# EAGLE board STM32F446 front pane - northeast - v3 (EAGLE 9.6.2), part 1 of 2
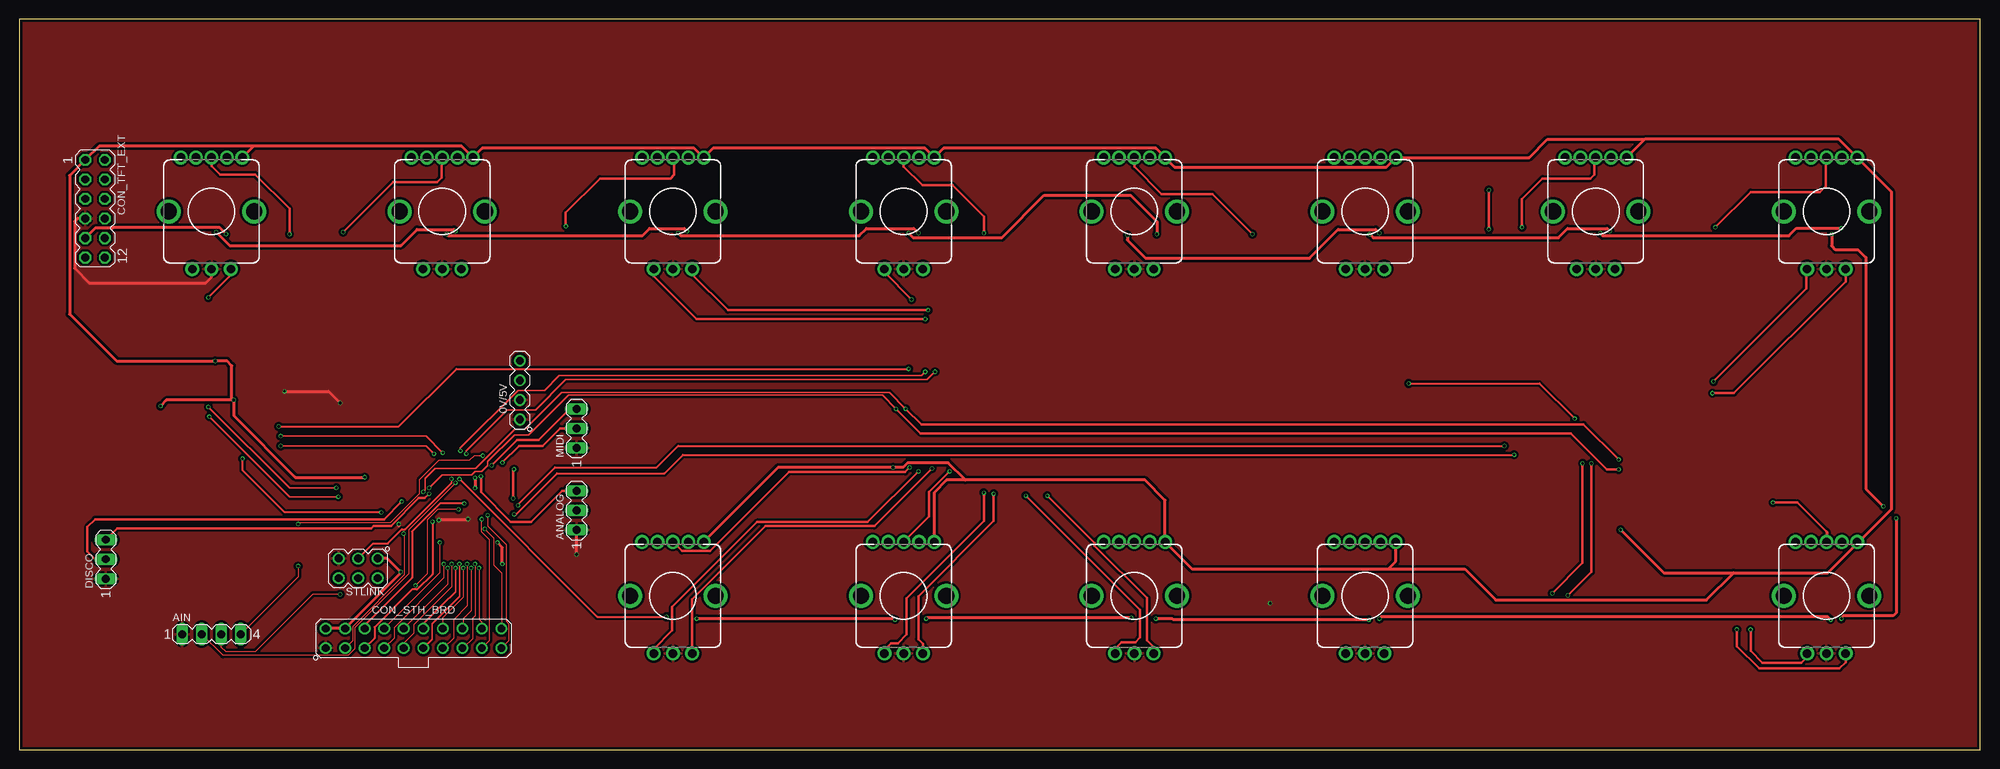
[diagram p5: board, top side]
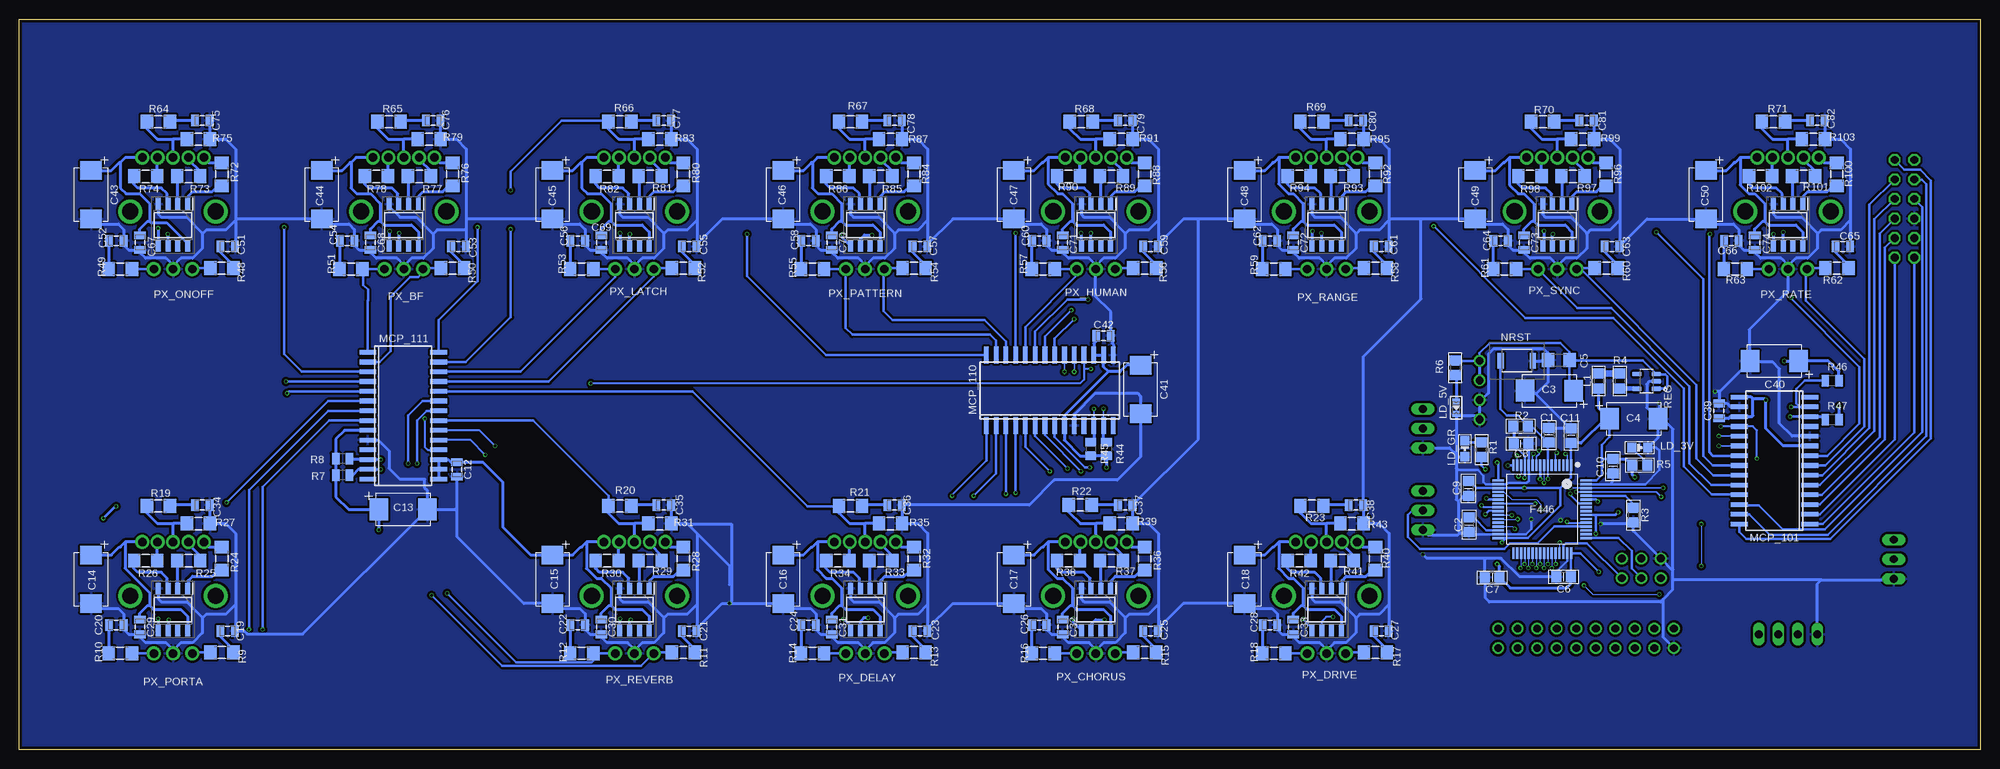
[diagram p6: board, bottom side, seen from below]

Size 255 x 95 mm. Coordinates in mm from the lower left corner, seen from the top.
Outline: 0,0 255,0 255,95 0,95 0,0
Copper layers (1*16): Top 0.035559375mm / dielectric 1.6mm / Bottom 0.035559375mm
Design rules "jlcpcb2layer": minimum track width 5mil, minimum drill 12mil, track to track 5mil, track to pad 5mil, pad to pad 5mil, via to via 5mil, smd to smd 5mil, copper to edge 8mil, drill to drill 6mil, minimum pad ring 5mil, minimum via ring 3mil, stop-mask expansion 2.5mil, vias tented up to drill 0mil, thermal gap 10mil

## Footprints (pad centres in the part's own frame; a part is rotated, then mirrored left to right if it is on the bottom)
MA04-1 = drill 1.016: 1 -3.81,0; 2 -1.27,0; 3 1.27,0; 4 3.81,0
MA04-1' = drill 1.016 long: 1 -3.81,0; 2 -1.27,0; 3 1.27,0; 4 3.81,0
MA03-1 = drill 1.016 long: 1 -2.54,0; 2 0,0; 3 2.54,0
C0805 = smd 1.3 x 1.5: 1 -0.95,0; 2 0.95,0
CPOL2917 = smd 2.4 x 2.8: + -3.15,0; - 3.15,0
C1206 = smd 1.6 x 1.8: 1 -1.4,0; 2 1.4,0
0805-CAP = smd 1 x 1.5: 1 -0.95,0; 2 0.95,0
MA10-2 = drill 1.016: 1 -11.43,-1.27; 2 -11.43,1.27; 3 -8.89,-1.27; 4 -8.89,1.27; 5 -6.35,-1.27; 6 -6.35,1.27; 7 -3.81,-1.27; 8 -3.81,1.27; 9 -1.27,-1.27; 10 -1.27,1.27; 11 1.27,-1.27; 12 1.27,1.27; 13 3.81,-1.27; 14 3.81,1.27; 15 6.35,-1.27; 16 6.35,1.27; 17 8.89,-1.27; 18 8.89,1.27; 19 11.43,-1.27; 20 11.43,1.27
MA06-2 = drill 1.016 octagon: 1 -6.35,-1.27; 2 -6.35,1.27; 3 -3.81,-1.27; 4 -3.81,1.27; 5 -1.27,-1.27; 6 -1.27,1.27; 7 1.27,-1.27; 8 1.27,1.27; 9 3.81,-1.27; 10 3.81,1.27; 11 6.35,-1.27; 12 6.35,1.27
QFP50P1200X1200X160-64N = smd 1.5 x 0.3: 1 -5.7,3.75; 2 -5.7,3.25; 3 -5.7,2.75; 4 -5.7,2.25; 5 -5.7,1.75; 6 -5.7,1.25; 7 -5.7,0.75; 8 -5.7,0.25; 9 -5.7,-0.25; 10 -5.7,-0.75; 11 -5.7,-1.25; 12 -5.7,-1.75; 13 -5.7,-2.25; 14 -5.7,-2.75; 15 -5.7,-3.25; 16 -5.7,-3.75; 33 5.7,-3.75; 34 5.7,-3.25; 35 5.7,-2.75; 36 5.7,-2.25; 37 5.7,-1.75; 38 5.7,-1.25; 39 5.7,-0.75; 40 5.7,-0.25; 41 5.7,0.25; 42 5.7,0.75; 43 5.7,1.25; 44 5.7,1.75; 45 5.7,2.25; 46 5.7,2.75; 47 5.7,3.25; 48 5.7,3.75 | smd 0.3 x 1.5: 17 -3.75,-5.7; 18 -3.25,-5.7; 19 -2.75,-5.7; 20 -2.25,-5.7; 21 -1.75,-5.7; 22 -1.25,-5.7; 23 -0.75,-5.7; 24 -0.25,-5.7; 25 0.25,-5.7; 26 0.75,-5.7; 27 1.25,-5.7; 28 1.75,-5.7; 29 2.25,-5.7; 30 2.75,-5.7; 31 3.25,-5.7; 32 3.75,-5.7; 49 3.75,5.7; 50 3.25,5.7; 51 2.75,5.7; 52 2.25,5.7; 53 1.75,5.7; 54 1.25,5.7; 55 0.75,5.7; 56 0.25,5.7; 57 -0.25,5.7; 58 -0.75,5.7; 59 -1.25,5.7; 60 -1.75,5.7; 61 -2.25,5.7; 62 -2.75,5.7; 63 -3.25,5.7; 64 -3.75,5.7
L0805 = smd 1.3 x 1.5: 1 -0.95,0; 2 0.95,0
0805-LED = smd 1.2 x 1.2: A -1.05,0; C 1.05,0
0603-LED = smd 0.8 x 1: A 0.825,0; C -0.825,0
SOIC-28 = smd 2.2 x 0.6: 1 -4.6,8.255; 2 -4.6,6.985; 3 -4.6,5.715; 4 -4.6,4.445; 5 -4.6,3.175; 6 -4.6,1.905; 7 -4.6,0.635; 8 -4.6,-0.635; 9 -4.6,-1.905; 10 -4.6,-3.175; 11 -4.6,-4.445; 12 -4.6,-5.715; 13 -4.6,-6.985; 14 -4.6,-8.255; 15 4.6,-8.255; 16 4.6,-6.985; 17 4.6,-5.715; 18 4.6,-4.445; 19 4.6,-3.175; 20 4.6,-1.905; 21 4.6,-0.635; 22 4.6,0.635; 23 4.6,1.905; 24 4.6,3.175; 25 4.6,4.445; 26 4.6,5.715; 27 4.6,6.985; 28 4.6,8.255
SKRKAEE020 = smd 0.8 x 2: 1 -2.1,0; 2 2.1,0
SOIC127P600X175-8N = smd 1.528 x 0.65: 1 -2.711,1.905; 2 -2.711,0.635; 3 -2.711,-0.635; 4 -2.711,-1.905; 5 2.711,-1.905; 6 2.711,-0.635; 7 2.711,0.635; 8 2.711,1.905
R0805 = smd 1.3 x 1.5: 1 -0.95,0; 2 0.95,0
R0805' = smd 1.016 x 1.422: 1 -0.889,0; 2 0.889,0
1206 = smd 1.6 x 1.8: 1 -1.5,0; 2 1.5,0
SOT95P280X145-5N = smd 1.21 x 0.59: 1 -1.255,0.95; 2 -1.255,0; 3 -1.255,-0.95; 4 1.255,-0.95; 5 1.255,0.95
ENCODER_LED_3 = drill 1.1 pad 1.778: 1 -4,7; 2 -2,7; 3 0,7; 4 2,7; 5 4,7 | drill 1.1 pad 1.8: A -2.5,-7.5; B 2.5,-7.5; C 0,-7.5 | drill 2.1: M1 -5.55,0; M2 5.55,0
MA03-2 = drill 1.016: 1 -2.54,-1.27; 2 -2.54,1.27; 3 0,-1.27; 4 0,1.27; 5 2.54,-1.27; 6 2.54,1.27

## Placement (x,y rotation side)
0V/5V  SUPPLY  [MA04-1]  65.1,46.75 90 top
AIN  [MA04-1']  25,15 0 top
ANALOG  UART_ANALOG  [MA03-1]  72.48,31.11 90 top
C1  0.1uF  [C0805]  56.1,40.89 270 bottom
C2  2.2uF  [C0805]  66.48,29.23 90 bottom
C3  10u  [CPOL2917]  56.05,46.65 180 bottom
C4  100 uF  [CPOL2917]  45.07,43.02 0 bottom
C5  1u  [C1206]  54.81,50.69 0 bottom
C6  0.1uF  [C0805]  54.19,22.46 0 bottom
C7  0.1uF  [C0805]  63.46,22.38 0 bottom
C8  0.1uF  [C0805]  59.72,39.78 180 bottom
C9  0.1uF  [C0805]  66.55,33.96 90 bottom
C10  0.1uF  [C0805]  47.77,36.86 90 bottom
C11  1.0uF  [C0805]  53.22,40.83 270 bottom
C12  100n  [0805-CAP]  198.08,36.44 270 bottom
C13  10u  [CPOL2917]  205.06,31.23 0 bottom
C14  10u  [CPOL2917]  245.67,22.16 270 bottom
C15  10u  [CPOL2917]  185.67,22.16 270 bottom
C16  10u  [CPOL2917]  155.67,22.16 270 bottom
C17  10u  [CPOL2917]  125.67,22.16 270 bottom
C18  10u  [CPOL2917]  95.67,22.16 270 bottom
C19  10n  [0805-CAP]  227.89,15.43 180 bottom
C20  10n  [0805-CAP]  242.37,16.19 180 bottom
C21  10n  [0805-CAP]  167.89,15.43 180 bottom
C22  10n  [0805-CAP]  182.37,16.19 180 bottom
C23  10n  [0805-CAP]  137.89,15.43 180 bottom
C24  10n  [0805-CAP]  152.37,16.19 180 bottom
C25  10n  [0805-CAP]  107.89,15.43 180 bottom
C26  10n  [0805-CAP]  122.37,16.19 180 bottom
C27  10n  [0805-CAP]  77.89,15.43 180 bottom
C28  10n  [0805-CAP]  92.37,16.19 180 bottom
C29  100n  [0805-CAP]  239.32,15.94 270 bottom
C30  100n  [0805-CAP]  179.32,15.94 270 bottom
C31  100n  [0805-CAP]  149.32,15.94 270 bottom
C32  100n  [0805-CAP]  119.32,15.94 270 bottom
C33  100n  [0805-CAP]  89.32,15.94 270 bottom
C34  10n  [0805-CAP]  231.19,31.81 0 bottom
C35  10n  [0805-CAP]  171.19,31.81 0 bottom
C36  10n  [0805-CAP]  141.19,31.81 0 bottom
C37  10n  [0805-CAP]  111.19,31.81 0 bottom
C38  10n  [0805-CAP]  81.19,31.81 0 bottom
C39  100n  [0805-CAP]  33.99,44.06 90 bottom
C40  10u  [CPOL2917]  26.76,50.54 180 bottom
C41  10u  [CPOL2917]  109.18,46.85 270 bottom
C42  100n  [0805-CAP]  114,53.84 0 bottom
C43  10u  [CPOL2917]  245.67,72.16 270 bottom
C44  10u  [CPOL2917]  215.67,72.16 270 bottom
C45  10u  [CPOL2917]  185.67,72.16 270 bottom
C46  10u  [CPOL2917]  155.67,72.16 270 bottom
C47  10u  [CPOL2917]  125.67,72.16 270 bottom
C48  10u  [CPOL2917]  95.67,72.16 270 bottom
C49  10u  [CPOL2917]  65.67,72.16 270 bottom
C50  10u  [CPOL2917]  35.67,72.16 270 bottom
C51  10n  [0805-CAP]  227.89,65.43 180 bottom
C52  10n  [0805-CAP]  242.37,66.19 180 bottom
C53  10n  [0805-CAP]  197.89,65.43 180 bottom
C54  10n  [0805-CAP]  212.37,66.19 180 bottom
C55  10n  [0805-CAP]  167.89,65.43 180 bottom
C56  10n  [0805-CAP]  182.37,66.19 180 bottom
C57  10n  [0805-CAP]  137.89,65.43 180 bottom
C58  10n  [0805-CAP]  152.37,66.19 180 bottom
C59  10n  [0805-CAP]  107.89,65.43 180 bottom
C60  10n  [0805-CAP]  122.37,66.19 180 bottom
C61  10n  [0805-CAP]  77.89,65.43 180 bottom
C62  10n  [0805-CAP]  92.37,66.19 180 bottom
C63  10n  [0805-CAP]  47.89,65.43 180 bottom
C64  10n  [0805-CAP]  62.37,66.19 180 bottom
C65  10n  [0805-CAP]  17.89,65.43 180 bottom
C66  10n  [0805-CAP]  32.37,66.19 180 bottom
C67  100n  [0805-CAP]  239.32,65.94 270 bottom
C68  100n  [0805-CAP]  209.32,65.94 270 bottom
C69  100n  [0805-CAP]  179.32,65.94 270 bottom
C70  100n  [0805-CAP]  149.32,65.94 270 bottom
C71  100n  [0805-CAP]  119.32,65.94 270 bottom
C72  100n  [0805-CAP]  89.32,65.94 270 bottom
C73  100n  [0805-CAP]  59.32,65.94 270 bottom
C74  100n  [0805-CAP]  29.32,65.94 270 bottom
C75  10n  [0805-CAP]  231.19,81.81 0 bottom
C76  10n  [0805-CAP]  201.19,81.81 0 bottom
C77  10n  [0805-CAP]  171.19,81.81 0 bottom
C78  10n  [0805-CAP]  141.19,81.81 0 bottom
C79  10n  [0805-CAP]  111.19,81.81 0 bottom
C80  10n  [0805-CAP]  81.19,81.81 0 bottom
C81  10n  [0805-CAP]  51.19,81.81 0 bottom
C82  10n  [0805-CAP]  21.19,81.81 0 bottom
CON_STH_BRD  SOUTH  [MA10-2]  51.27,14.47 0 top
CON_TFT_EXT  TFT_EXT  [MA06-2]  9.87,70.35 270 top
DISCO  UART_DISCO  [MA03-1]  11.26,24.76 90 top
F446  STM32F446RCT7  [QFP50P1200X1200X160-64N]  56.97,31.26 270 bottom
L1  1 uH  [L0805]  49.63,47.95 270 bottom
LD_3V  LED_3V3  [0805-LED]  44.27,39.26 0 bottom
LD_5V  LED_5V  [0603-LED]  68.15,44.47 90 bottom
LD_GR  [0805-LED]  67.01,39.13 270 bottom
MCP_101  MCP23017  [SOIC-28]  26.76,37.58 180 bottom
MCP_110  MCP23017  [SOIC-28]  120.99,46.73 90 bottom
MCP_111  MCP23017  [SOIC-28]  205.06,43.43 0 bottom
MIDI  UART_MIDI  [MA03-1]  72.48,41.77 90 top
NRST  SWITCH-SKRKAEE020  [SKRKAEE020]  60.27,50.56 180 bottom
PX_BF  NEOPIXEL-TLC59731DR  [SOIC127P600X175-8N]  205,68.22 270 bottom
PX_CHORUS  NEOPIXEL-TLC59731DR  [SOIC127P600X175-8N]  115,18.22 270 bottom
PX_DELAY  NEOPIXEL-TLC59731DR  [SOIC127P600X175-8N]  145,18.22 270 bottom
PX_DRIVE  NEOPIXEL-TLC59731DR  [SOIC127P600X175-8N]  85,18.22 270 bottom
PX_HUMAN  NEOPIXEL-TLC59731DR  [SOIC127P600X175-8N]  115,68.22 270 bottom
PX_LATCH  NEOPIXEL-TLC59731DR  [SOIC127P600X175-8N]  175,68.22 270 bottom
PX_ONOFF  NEOPIXEL-TLC59731DR  [SOIC127P600X175-8N]  235,68.22 270 bottom
PX_PATTERN  NEOPIXEL-TLC59731DR  [SOIC127P600X175-8N]  145,68.22 270 bottom
PX_PORTA  NEOPIXEL-TLC59731DR  [SOIC127P600X175-8N]  235,18.22 270 bottom
PX_RANGE  NEOPIXEL-TLC59731DR  [SOIC127P600X175-8N]  85,68.22 270 bottom
PX_RATE  NEOPIXEL-TLC59731DR  [SOIC127P600X175-8N]  25,68.22 270 bottom
PX_REVERB  NEOPIXEL-TLC59731DR  [SOIC127P600X175-8N]  175,18.22 270 bottom
PX_SYNC  NEOPIXEL-TLC59731DR  [SOIC127P600X175-8N]  55,68.22 270 bottom
R1  1k  [R0805]  64.85,39 90 bottom
R2  100k  [R0805]  59.77,42.05 0 bottom
R3  10K  [R0805]  45.12,30.48 270 bottom
R4  1  [R0805]  46.88,47.95 270 bottom
R5  1k  [R0805]  44.27,36.97 0 bottom
R6  470  [R0805]  68.28,49.67 270 bottom
R7  1k  [R0805']  212.94,35.68 180 bottom
R8  1k  [R0805']  212.94,37.84 180 bottom
R9  470  [1206]  228.65,12.63 0 bottom
R10  470  [1206]  241.86,12.51 180 bottom
R11  470  [1206]  168.65,12.63 0 bottom
R12  470  [1206]  181.86,12.51 180 bottom
R13  470  [1206]  138.65,12.63 0 bottom
R14  470  [1206]  151.86,12.51 180 bottom
R15  470  [1206]  108.65,12.63 0 bottom
R16  470  [1206]  121.86,12.51 180 bottom
R17  470  [1206]  78.65,12.63 0 bottom
R18  470  [1206]  91.86,12.51 180 bottom
R19  470  [1206]  236.91,31.68 0 bottom
R20  470  [1206]  176.91,31.68 0 bottom
R21  470  [1206]  146.91,31.68 0 bottom
R22  470  [1206]  117.03,31.81 0 bottom
R23  470  [1206]  86.91,31.68 0 bottom
R24  100  [1206]  228.65,24.83 90 bottom
R25  100  [1206]  232.97,24.57 0 bottom
R26  100  [1206]  238.56,24.57 0 bottom
R27  10k  [1206]  231.7,29.4 0 bottom
R28  100  [1206]  168.65,24.83 90 bottom
R29  100  [1206]  172.97,24.57 0 bottom
R30  100  [1206]  178.56,24.57 0 bottom
R31  10k  [1206]  171.7,29.4 0 bottom
R32  100  [1206]  138.65,24.83 90 bottom
R33  100  [1206]  142.97,24.57 0 bottom
R34  100  [1206]  148.56,24.57 0 bottom
R35  10k  [1206]  141.7,29.4 0 bottom
R36  100  [1206]  108.65,24.83 90 bottom
R37  100  [1206]  112.97,24.57 0 bottom
R38  100  [1206]  118.56,24.57 0 bottom
R39  10k  [1206]  111.7,29.4 0 bottom
R40  100  [1206]  78.65,24.83 90 bottom
R41  100  [1206]  82.97,24.57 0 bottom
R42  100  [1206]  88.56,24.57 0 bottom
R43  10k  [1206]  81.7,29.4 0 bottom
R44  1k  [R0805']  113.62,39.11 270 bottom
R45  1k  [R0805']  115.66,39.11 270 bottom
R46  1k  [R0805']  19.26,48 0 bottom
R47  1k  [R0805']  19.26,42.92 0 bottom
R48  470  [1206]  228.65,62.63 0 bottom
R49  470  [1206]  241.86,62.51 180 bottom
R50  470  [1206]  198.65,62.63 0 bottom
R51  470  [1206]  211.86,62.51 180 bottom
R52  470  [1206]  168.65,62.63 0 bottom
R53  470  [1206]  181.86,62.51 180 bottom
R54  470  [1206]  138.65,62.63 0 bottom
R55  470  [1206]  151.86,62.51 180 bottom
R56  470  [1206]  108.65,62.63 0 bottom
R57  470  [1206]  121.86,62.51 180 bottom
R58  470  [1206]  78.65,62.63 0 bottom
R59  470  [1206]  91.86,62.51 180 bottom
R60  470  [1206]  48.65,62.63 0 bottom
R61  470  [1206]  61.86,62.51 180 bottom
R62  470  [1206]  18.65,62.63 0 bottom
R63  470  [1206]  31.86,62.51 180 bottom
R64  470  [1206]  236.91,81.68 0 bottom
R65  470  [1206]  206.91,81.68 0 bottom
R66  470  [1206]  176.91,81.68 0 bottom
R67  470  [1206]  146.91,81.68 0 bottom
R68  470  [1206]  116.91,81.68 0 bottom
R69  470  [1206]  86.91,81.68 0 bottom
R70  470  [1206]  56.91,81.68 0 bottom
R71  470  [1206]  26.91,81.68 0 bottom
R72  100  [1206]  228.65,74.83 90 bottom
R73  100  [1206]  232.97,74.57 0 bottom
R74  100  [1206]  238.56,74.57 0 bottom
R75  10k  [1206]  231.7,79.4 0 bottom
R76  100  [1206]  198.65,74.83 90 bottom
R77  100  [1206]  202.97,74.57 0 bottom
R78  100  [1206]  208.56,74.57 0 bottom
R79  10k  [1206]  201.7,79.4 0 bottom
R80  100  [1206]  168.65,74.83 90 bottom
R81  100  [1206]  172.97,74.57 0 bottom
R82  100  [1206]  178.56,74.57 0 bottom
R83  10k  [1206]  171.7,79.4 0 bottom
R84  100  [1206]  138.65,74.83 90 bottom
R85  100  [1206]  142.97,74.57 0 bottom
R86  100  [1206]  148.56,74.57 0 bottom
R87  10k  [1206]  141.7,79.4 0 bottom
R88  100  [1206]  108.65,74.83 90 bottom
R89  100  [1206]  112.97,74.57 0 bottom
R90  100  [1206]  118.56,74.57 0 bottom
R91  10k  [1206]  111.7,79.4 0 bottom
R92  100  [1206]  78.65,74.83 90 bottom
R93  100  [1206]  82.97,74.57 0 bottom
R94  100  [1206]  88.56,74.57 0 bottom
R95  10k  [1206]  81.7,79.4 0 bottom
R96  100  [1206]  48.65,74.83 90 bottom
R97  100  [1206]  52.97,74.57 0 bottom
R98  100  [1206]  58.56,74.57 0 bottom
R99  10k  [1206]  51.7,79.4 0 bottom
R100  100  [1206]  18.65,74.83 90 bottom
R101  100  [1206]  22.97,74.57 0 bottom
R102  100  [1206]  28.56,74.57 0 bottom
R103  10k  [1206]  21.7,79.4 0 bottom
REG  TLV75533PDBVR  [SOT95P280X145-5N]  43.38,47.89 180 bottom
S2  [ENCODER_LED_3]  235,20 0 top
S3  [ENCODER_LED_3]  175,20 0 top
S4  [ENCODER_LED_3]  145,20 0 top
S5  [ENCODER_LED_3]  115,20 0 top
S6  [ENCODER_LED_3]  85,20 0 top
S7  [ENCODER_LED_3]  235,70 0 top
S8  [ENCODER_LED_3]  205,70 0 top
S9  [ENCODER_LED_3]  175,70 0 top
S10  [ENCODER_LED_3]  145,70 0 top
S11  [ENCODER_LED_3]  115,70 0 top
S12  [ENCODER_LED_3]  85,70 0 top
S13  [ENCODER_LED_3]  55,70 0 top
S14  [ENCODER_LED_3]  25,70 0 top
STLINK  STLINK  [MA03-2]  44.07,23.57 180 top